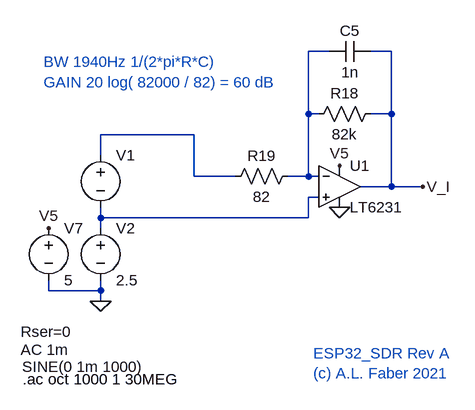
[diagram p0: schematic qsd_amp_integrator.asc]
qsd_amp_integrator.asc, the LTspice schematic file:
Version 4
SHEET 1 2544 1324
WIRE 608 -192 576 -192
WIRE 704 -192 672 -192
WIRE 576 -96 576 -192
WIRE 592 -96 576 -96
WIRE 704 -96 704 -192
WIRE 704 -96 672 -96
WIRE 400 -64 256 -64
WIRE 256 -32 256 -64
WIRE 400 0 400 -64
WIRE 464 0 400 0
WIRE 576 0 576 -96
WIRE 576 0 544 0
WIRE 592 0 576 0
WIRE 704 16 704 -96
WIRE 704 16 656 16
WIRE 752 16 704 16
WIRE 592 32 576 32
WIRE 256 64 256 48
WIRE 576 64 576 32
WIRE 576 64 256 64
WIRE 256 80 256 64
WIRE 176 176 176 160
WIRE 256 176 256 160
WIRE 256 176 176 176
WIRE 256 192 256 176
FLAG 176 80 V5
FLAG 256 192 0
FLAG 624 -16 V5
FLAG 624 48 0
FLAG 752 16 V_I
SYMBOL voltage 256 -48 R0
WINDOW 3 -121 341 Left 2
WINDOW 123 -123 315 Left 2
WINDOW 39 -123 287 Left 2
SYMATTR Value SINE(0 1m 1000)
SYMATTR Value2 AC 1m
SYMATTR SpiceLine Rser=0
SYMATTR InstName V1
SYMBOL voltage 256 64 R0
WINDOW 123 0 0 Left 0
WINDOW 39 0 0 Left 0
SYMATTR InstName V2
SYMATTR Value 2.5
SYMBOL voltage 176 64 R0
WINDOW 123 0 0 Left 0
WINDOW 39 0 0 Left 0
SYMATTR InstName V7
SYMATTR Value 5
SYMBOL res 688 -112 R90
WINDOW 0 0 56 VBottom 2
WINDOW 3 32 56 VTop 2
SYMATTR InstName R18
SYMATTR Value 82k
SYMBOL cap 672 -208 R90
WINDOW 0 0 32 VBottom 2
WINDOW 3 32 32 VTop 2
SYMATTR InstName C5
SYMATTR Value 1n
SYMBOL res 560 -16 R90
WINDOW 0 0 56 VBottom 2
WINDOW 3 32 56 VTop 2
SYMATTR InstName R19
SYMATTR Value 82
SYMBOL Opamps\\LT6231 624 16 R0
SYMATTR InstName U1
TEXT 136 312 Left 2 !.ac oct 1000 1 30MEG
TEXT 168 -176 Left 2 ;BW 1940Hz 1/(2*pi*R*C)\nGAIN 20 log( 82000 / 82) = 60 dB
TEXT 584 272 Left 2 ;ESP32_SDR Rev A \n(c) A.L. Faber 2021

The netlist it stands for:
* qsd_amp_integrator.asc
V1 N002 N003 SINE(0 1m 1000) AC 1m Rser=0
V2 N003 0 2.5
V7 V5 0 5
R18 V_I N001 82k
C5 V_I N001 1n
R19 N001 N002 82
XU1 N003 N001 V_I V5 0 LT6231  ; pins In+ In- OUT V+ V-
.ac oct 1000 1 30MEG
* BW 1940Hz 1/(2*pi*R*C)
* GAIN 20 log( 82000 / 82) = 60 dB
* ESP32_SDR Rev A
* (c) A.L. Faber 2021
.lib LTC2.lib
.backanno
.end